# Altium schematic sheet Thermal_MGM.SchDoc: Thermal
size 420 x 297 mm; Author: G.K.; CompanyName: WUT; DrawnBy: G.K.; Organization: WUT ISE; Address1: Warsaw Univeristy of Technology; Address2: Nowowiejska 15/19; DocumentNumber: 6; Revision: -; SheetNumber: 6; SheetTotal: 7; EDA_Number: ARTIQ; Projet: ARTIQ/SINARA; ModifiedBy: -; CreateDate: XX/XX/XXXX; CheckedDate: -; Title2: management; DivGrp: ISE; Designer: G.K.; ModifiedDate: -; ProjectName: 32 CHANNEL 16bit DAC
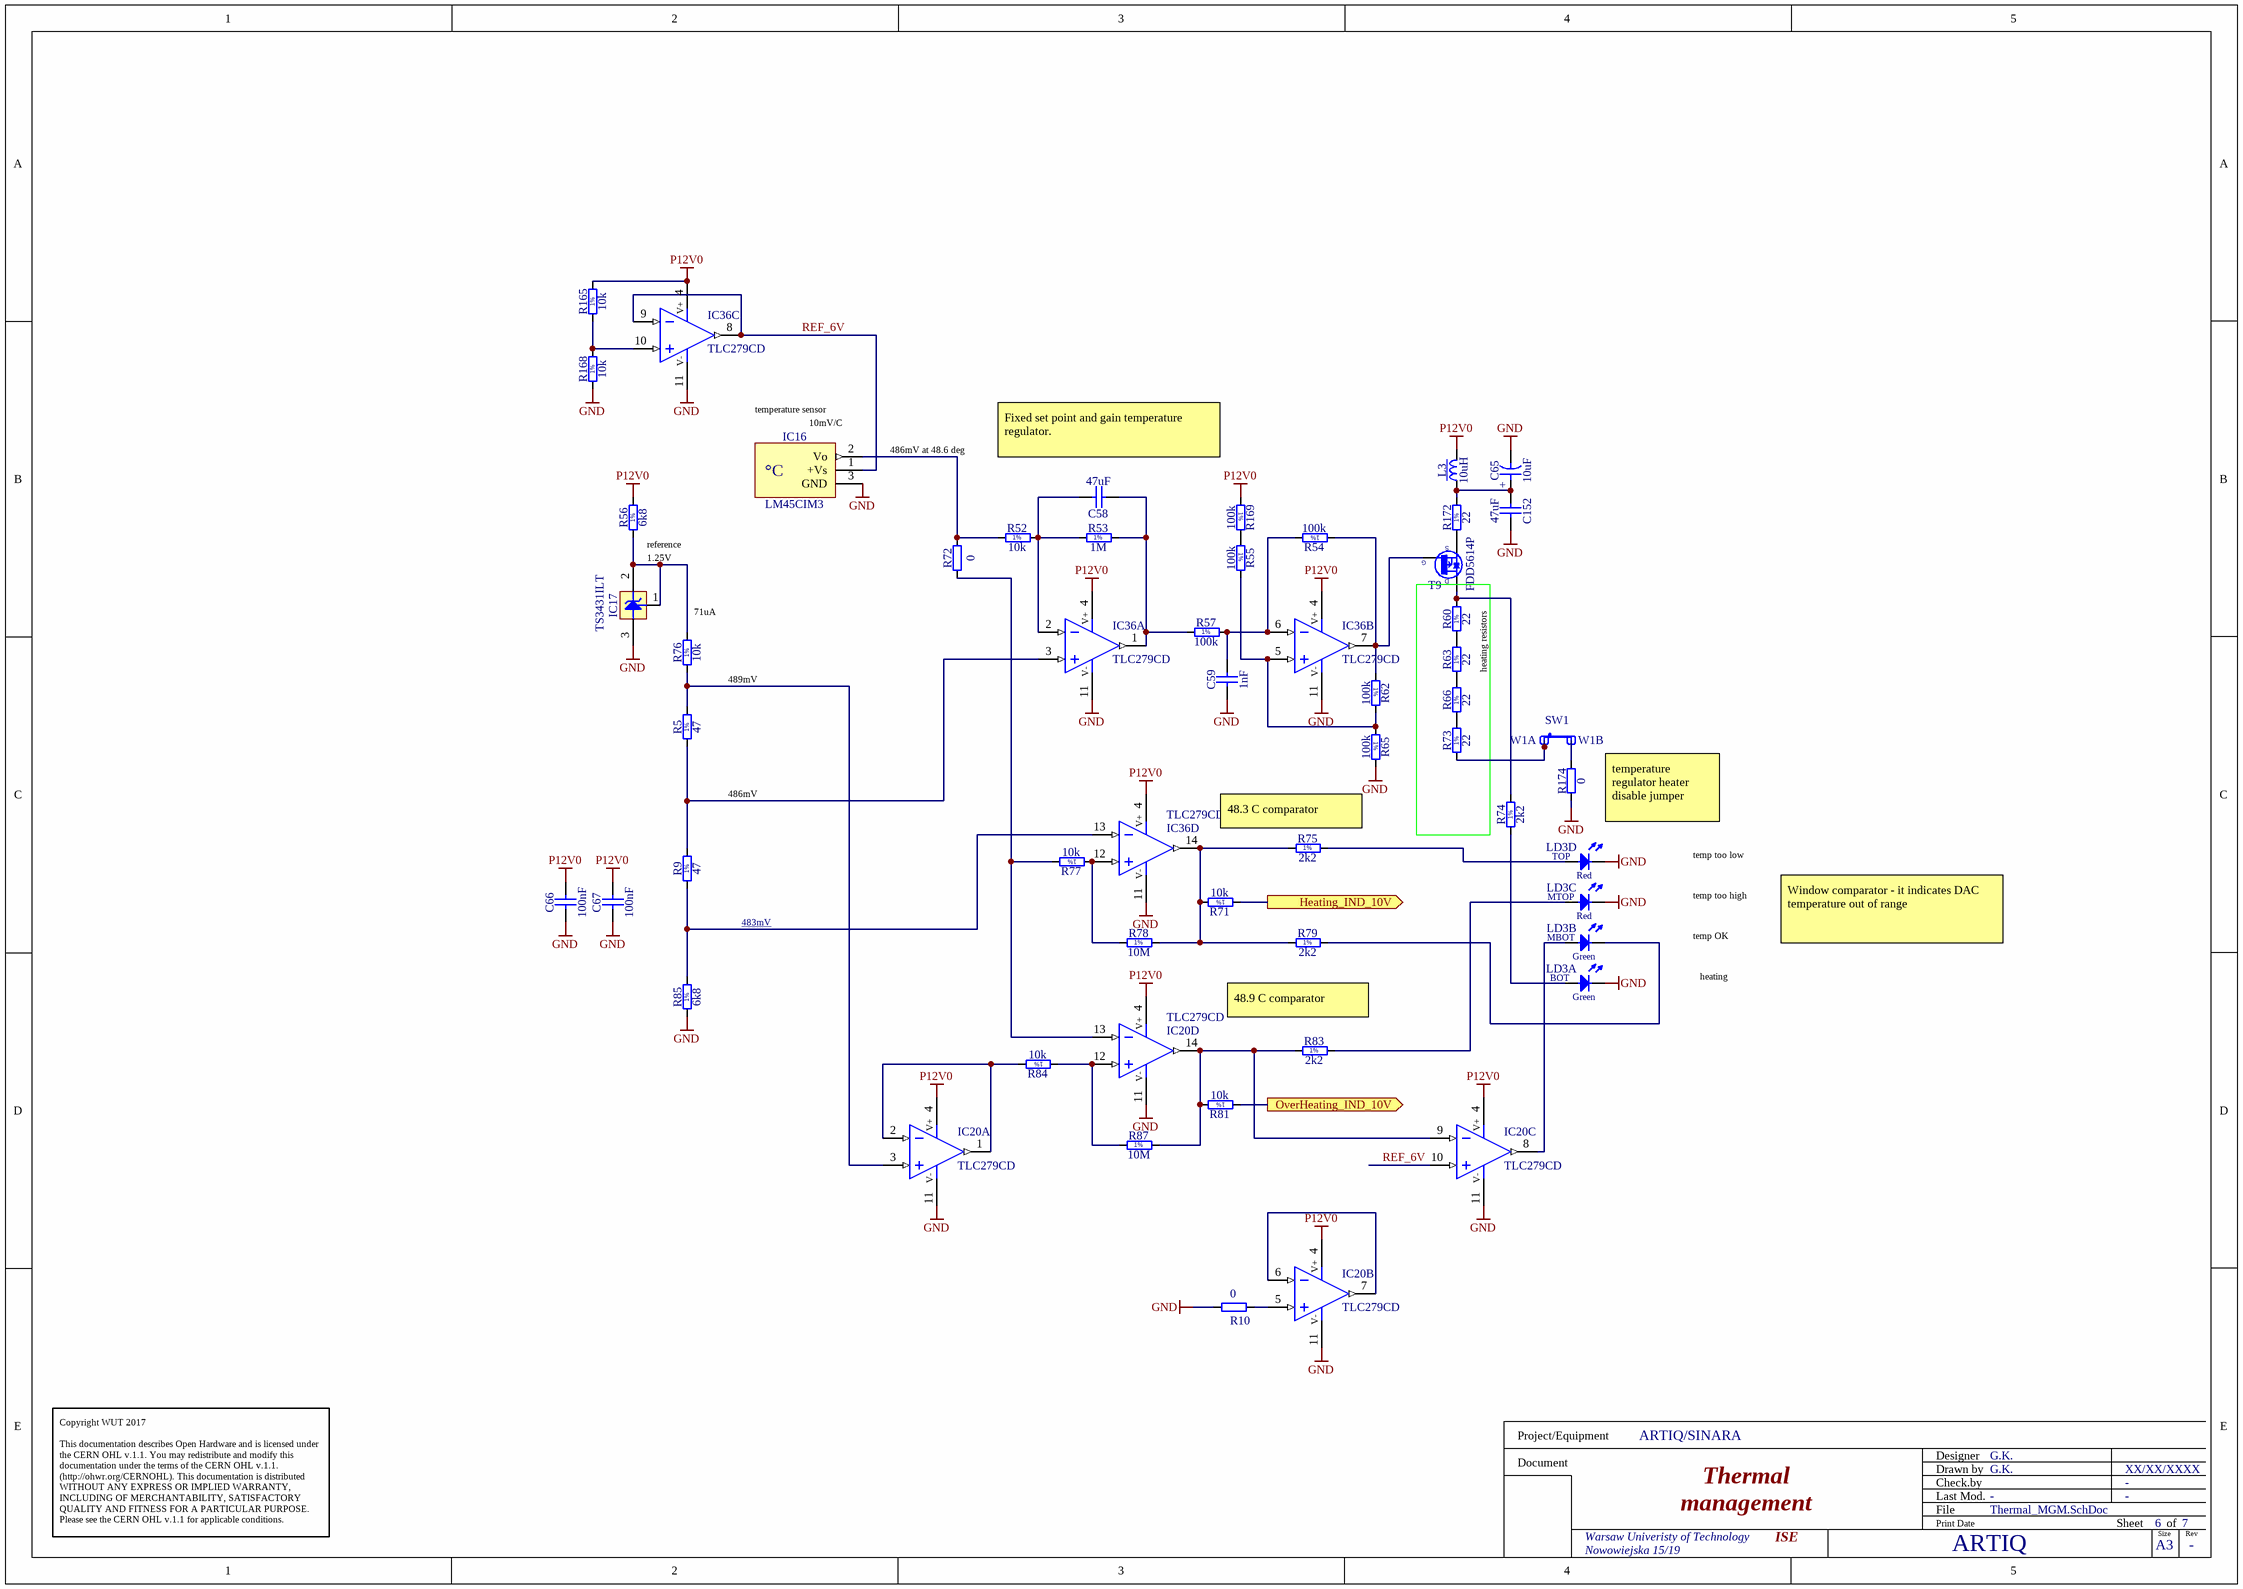
[diagram p0: Thermal_MGM.SchDoc]

## Parts
C58  47uF  [CAPC3225X270N]
C59  1nF  [CAPC1608X87N]
C65  10uF  [CAPMP3216X180N]
C66  100nF  [CAPC1005X55N]
C67  100nF  [CAPC1005X55N]
C152  47uF  [CAPC3225X270N]
IC16  LM45CIM3  [SOT95P251X112-3N]
IC17  TS3431ILT  [SOT95P237X112-3N]
IC20  TLC279CD  [SOIC127P600X175-14N]  (parts A,B,C,D of 4)
IC36  TLC279CD  [SOIC127P600X175-14N]  (parts A,B,C,D of 4)
L3  10uH  [IND_MURATA-PS_8400]
LD3  Green/Green/HeRed/HeRed  [LED_BIVAR_H485CHHGGDL]  (value not drawn)  (parts A,B,C,D of 4)
R5  47  [RESC1608X55N]
R9  47  [RESC1608X55N]
R10  0  [RESC1005X40N]
R52  10k  [RESC1608X55N]
R53  1M  [RESC1608X55N]
R54  100k  [RESC1608X55N]
R55  100k  [RESC1608X55N]
R56  6k8  [RESC1608X55N]
R57  100k  [RESC1608X55N]
R60  22  [RESC3216X65N]
R62  100k  [RESC1608X55N]
R63  22  [RESC3216X65N]
R65  100k  [RESC1608X55N]
R66  22  [RESC3216X65N]
R71  10k  [RESC1608X55N]
R72  0  [RESC1005X40N]
R73  22  [RESC3216X65N]
R74  2k2  [RESC1608X55N]
R75  2k2  [RESC1608X55N]
R76  10k  [RESC1608X55N]
R77  10k  [RESC1608X55N]
R78  10M  [RESC1508X63N]
R79  2k2  [RESC1608X55N]
R81  10k  [RESC1608X55N]
R83  2k2  [RESC1608X55N]
R84  10k  [RESC1608X55N]
R85  6k8  [RESC1608X55N]
R87  10M  [RESC1508X63N]
R165  10k  [RESC1608X55N]
R168  10k  [RESC1608X55N]
R169  100k  [RESC1608X55N]
R172  22  [RESC3216X65N]
R174  0  [RESC1005X40N]
SW1  Jumper Type1  [JUMPER_BLACK_INSULATED_2.54MM]  (value not drawn)
T9  FDD5614P  [TO228P991X238-3N-R546X521]
W1  Test Point  [COMATEL_385.0358.1.02.400]  (value not drawn)  (parts A,B of 2)

## Ports
Heating_IND_10V (out), OverHeating_IND_10V (out)

## Nets
GND: C59.1 C65.2 C66.1 C67.1 C152.2 IC16.3(GND) IC17.3(A) IC20.11(V-) IC36.11(V-) LD3.1(C) LD3.5(C) LD3.7(C) R10.2 R65.2 R85.1 R168.1 R174.1
P12V0: C66.2 C67.2 IC20.4(V+) IC36.4(V+) L3.2 R56.2 R165.2 R169.1
Heating_IND_10V: R71.1 ; port Heating_IND_10V
OverHeating_IND_10V: R81.1 ; port OverHeating_IND_10V
REF_6V: IC16.1(+Vs) IC20.10(IN+) IC36.8(OUT) IC36.9(IN-)
NetC58_1: C58.1 IC36.1(OUT) R53.2 R57.1
NetC58_2: C58.2 IC36.2(IN-) R52.2 R53.1
NetC59_2: C59.2 IC36.6(IN-) R54.2 R57.2
NetC65_1: C65.1 C152.1 L3.1 R172.2
NetIC16_2: IC16.2(Vo) R52.1 R72.2
NetIC17_1: IC17.1(Adj) IC17.2(C) R56.1 R76.2
NetIC20_1: IC20.1(OUT) IC20.2(IN-) R84.2
NetIC20_3: IC20.3(IN+) R5.2 R76.1
NetIC20_5: IC20.5(IN+) R10.1
NetIC20_6: IC20.6(IN-) IC20.7(OUT)
NetIC20_8: IC20.8(OUT) LD3.4(A)
NetIC20_9: IC20.9(IN-) IC20.14(OUT) R81.2 R83.1 R87.2
NetIC20_12: IC20.12(IN+) R84.1 R87.1
NetIC20_13: IC20.13(IN-) R72.1 R77.2
NetIC36_3: IC36.3(IN+) R5.1 R9.2
NetIC36_5: IC36.5(IN+) R55.2 R62.2 R65.1
NetIC36_7: IC36.7(OUT) R54.1 R62.1 T9.1(G)
NetIC36_10: IC36.10(IN+) R165.1 R168.2
NetIC36_12: IC36.12(IN+) R77.1 R78.1
NetIC36_13: IC36.13(IN-) R9.1 R85.2
NetIC36_14: IC36.14(OUT) R71.2 R75.1 R78.2 R79.1
NetLD3_2: LD3.2(A) R74.1
NetLD3_3: LD3.3(C) R79.2
NetLD3_6: LD3.6(A) R83.2
NetLD3_8: LD3.8(A) R75.2
NetR55_1: R55.1 R169.2
NetR60_1: R60.1 R63.2
NetR60_2: R60.2 R74.2 T9.3(D)
NetR63_1: R63.1 R66.2
NetR66_1: R66.1 R73.2
NetR73_1: R73.1 SW1.1 W1.1
NetR172_1: R172.1 T9.2(S)
NetR174_2: R174.2 W1.2

## Notes on the sheet
- temperature sensor
- (near IC16) 10mV/C
- 486mV at 48.6 deg
- Fixed set point and gain temperature regulator.
- 1.25V
- (near R56) reference
- (near R76) 71uA
- heating resistors
- 489mV
- 486mV
- (near R75) 48.3 C comparator
- temperature regulator heater disable jumper
- temp too low
- 483mV
- temp too high
- temp OK
- Window comparator - it indicates DAC temperature out of range
- heating
- 48.9 C comparator
- Copyright WUT 2017
  This documentation describes Open Hardware and is licensed under the CERN OHL v.1.1. You may redistribute and modify this documentation under the terms of the CERN OHL v.1.1. (http://ohwr.org/CERNOHL). This documentation is distributed WITHOUT ANY EXPRESS OR IMPLIED WARRANTY, INCLUDING OF MERCHANTABILITY, SATISFACTORY QUALITY AND FITNESS FOR A PARTICULAR PURPOSE. Please see the CERN OHL v.1.1 for applicable conditions.
- Project/Equipment
- Document
- Designer
- Drawn by
- Check.by
- File
- Last Mod.
- Print Date
- Sheet
- Size
- A3
- of
- Rev
- (in symbol CTE3216-18_10UF_16V_20%_AVX_TCJ) +
- (in symbol LED_BIVAR_H485CHHGGDL, part A) BOT; Green
- (in symbol LED_BIVAR_H485CHHGGDL, part B) MBOT; Green
- (in symbol LED_BIVAR_H485CHHGGDL, part C) MTOP; Red
- (in symbol LED_BIVAR_H485CHHGGDL, part D) TOP; Red
- (in symbol LM45CIM3) °C
- (in symbol R0603_1M_1%_0.1W_100PPM) 1%
- (in symbol R0603_2K2_1%_0.1W_100PPM) 1%
- (in symbol R0603_6K8_1%_0.1W_100PPM) 1%
- (in symbol R0603_10K_1%_0.1W_100PPM) 1%
- (in symbol R0603_10M_1%_0.125W_100PPM_VISHAY_CHP) 1%
- (in symbol R0603_47R_1%_0.1W_100PPM) 1%
- (in symbol R0603_100K_1%_0.1W_100PPM) 1%
- (in symbol R1206_22R_1%_0.25W_100PPM) 1%

## Library data of the parts
C58 C152 = CC1210_47UF_10V_10%_X7R: Non-polarised capacitor; Part Description: SMD Multilayer Chip Ceramic Capacitor; Manufacturer: GENERIC; Manufacturer1 Part Number: GRM32ER71A476KE15; Voltage: 10V; TC: X7R; Tolerance: ±10%; Part Number: CC1210_47UF_10V_10%_X7R; Component Kind: Standard; Component Type: Standard; Pin Count: 2; Value: 47uF; Status: None; Manufacturer Part Number: CC1210_47UF_10V_10%_X7R; Case: 1210; Mounted: Yes; Socket: No; SMD: Yes; Sense: No; Manufacturer1 Example: MURATA; Manufacturer1 ComponentHeight: 2.7mm; HelpURL: \\cern.ch\dfs\Applications\Altium\Datasheets\CC1210_X7R_MURATA.pdf; Author: CERN DEM BC; CreateDate: 18.11.2015; LatestRevisionDate: 18.11.2015
C59 = CC0603_1NF_50V_10%_X7R: Non-polarised capacitor; Part Description: SMD Multilayer Chip Ceramic Capacitor; Manufacturer: GENERIC; Manufacturer1 Part Number: 223858615623; Voltage: 50V; TC: X7R; Tolerance: ±10%; Part Number: CC0603_1NF_50V_10%_X7R; Component Kind: Standard; Component Type: Standard; Pin Count: 2; Value: 1nF; Status: Preferred; Manufacturer Part Number: CC0603_1NF_50V_10%_X7R; Case: 0603; Mounted: Yes; Socket: No; SMD: Yes; Sense: No; Manufacturer1 Example: PHYCOMP; Manufacturer1 ComponentHeight: 0.87mm; HelpURL: \\cern.ch\dfs\Applications\Altium\Datasheets\CC0603_X7R_PHYCOMP.pdf; Author: CERN DEM JLC; CreateDate: 03.12.2007; LatestRevisionDate: 03.12.2007
C65 = CTE3216-18_10UF_16V_20%_AVX_TCJ: Polarised capacitor; Part Description: ESR 0R200 Tantalum Solid Electrolytic Chip Capacitor with Conductive Polymer Electrode; Manufacturer: AVX; Manufacturer Part Number: TCJA106M016R0200; Voltage: 16V; Tolerance: ±20%; Part Number: CTE3216-18_10UF_16V_20%_AVX_TCJ; Component Kind: Standard; Component Type: Standard; Pin Count: 2; Value: 10uF; Status: Preferred; Case: A; Mounted: Yes; Socket: No; SMD: Yes; Sense: No; ComponentHeight: 1.8mm; HelpURL: \\cern.ch\dfs\Applications\Altium\Datasheets\CTE_AVX_TCJ.pdf; Author: CERN DEM JLC; CreateDate: 29.03.2012; LatestRevisionDate: 29.03.2012
C66 C67 = CC0402_100NF_16V_10%_X7R: Non-polarised capacitor; Part Description: SMD Multilayer Chip Ceramic Capacitor; Manufacturer: GENERIC; Manufacturer1 Part Number: GRM155R71C104KA88D; Voltage: 16V; TC: X7R; Tolerance: ±10%; Part Number: CC0402_100NF_16V_10%_X7R; Component Kind: Standard; Component Type: Standard; Pin Count: 2; Value: 100nF; Status: Not Recommended; Manufacturer Part Number: CC0402_100NF_16V_10%_X7R; Case: 0402; Mounted: Yes; Socket: No; SMD: Yes; Sense: No; Manufacturer1 Example: MURATA; Manufacturer1 ComponentHeight: 0.55mm; HelpURL: \\cern.ch\dfs\Applications\Altium\Datasheets\CC0402_X7R_MURATA_GRM.pdf; Author: CERN DEM JLC; CreateDate: 2013-12-05; LatestRevisionDate: 2007-12-03
IC16 = LM45CIM3: -20° to +100°C ±3°C Precision Centigrade Temperature Sensors; Manufacturer: NATIONAL SEMICONDUCTOR; PressFit: No; Bonding: No; Part Number: LM45CIM3; Component Kind: Standard; Component Type: Standard; Device: LM45CIM3; PackageDescription: SOT23 3-Leads, Pitch 0.95mm - Body 1.3x2.9mm, IPC Medium Density; Status: Obsolete; Part Description: -20° to +100°C ±3°C Precision Centigrade Temperature Sensors; Manufacturer Part Number: LM45CIM3; Pin Count: 3; Case: SOT23; Mounted: Yes; Socket: No; SMD: Yes; Sense: No; ComponentHeight: 1.12mm; HelpURL: \\cern.ch\dfs\Applications\Altium\Datasheets\LM45CIM3.pdf; Author: CERN DEM JLC; CreateDate: 02.12.2009; LatestRevisionDate: 02.12.2009
IC17 = TS3431ILT: Precision Reference 1=Adj 2=Cathode 3=Anode; Part Description: 1.24 V Programmable Shunt Voltage Reference; Manufacturer: ST MICROELECTRONICS; PressFit: No; Bonding: No; Part Number: TS3431ILT; Component Kind: Standard; Component Type: Standard; Device: TS3431ILT; PackageDescription: SOT, 0.95mm, pitch; 3 pin,1.30mm W X 2.92mm L X 1.12mm H body, IPC Medium Density; Manufacturer Part Number: TS3431ILT; Pin Count: 3; Case: SOT23; Mounted: Yes; Socket: No; SMD: Yes; Sense: No; ComponentHeight: 1.12mm; HelpURL: \\cern.ch\dfs\Applications\Altium\Datasheets\TS3431ILT.pdf; Author: CERN DEM JLC; CreateDate: 17.11.2016; LatestRevisionDate: 17.11.2016
IC20 IC36 = OA_TLC279CD: LinCMOS Precision (900uV) Quad Operational Amplifier; Part Description: LinCMOS Precision Quad Operational Amplifier; Manufacturer: TEXAS INSTRUMENTS; PressFit: No; Bonding: No; Part Number: TLC279CD; Component Kind: Standard; Component Type: Standard; Device: TLC279CD; PackageDescription: SOIC 14, Pitch 1.27mm - Body 4x8.75mm, IPC Medium Density; Manufacturer Part Number: TLC279CD; Pin Count: 14; Case: SOIC14; Mounted: Yes; Socket: No; SMD: Yes; Sense: No; ComponentHeight: 1.75mm; Author: CERN DEM JLC; HelpURL: \\cern.ch\dfs\Applications\Altium\Datasheets\TLC274CD.pdf; CreateDate: 18.01.2011; LatestRevisionDate: 18.01.2011
L3 = IND_10UH_10%_MURATA-PS_8400: Inductor With Core; Part Description: Miniature Surface Mount Power Inductor (8400 Serie); Manufacturer: MURATA POWER SOLUTIONS; Manufacturer Part Number: 84103C; Power: 950mA; Resistance: 0.24R; Tolerance: ±10%; Part Number: IND_10UH_10%_MURATA-PS_8400; Component Kind: Standard; Component Type: Standard; Pin Count: 2; Value: 10uH; Status: None; Mounted: Yes; Socket: No; SMD: Yes; Sense: No; ComponentHeight: 2.9mm; HelpURL: \\cern.ch\dfs\Applications\Altium\Datasheets\IND_MURATA-PS_8400.pdf; Author: CERN DEM JLC; CreateDate: 02.07.2012; LatestRevisionDate: 02.07.2012
LD3 = LED_BIVAR_H485CHHGGDL: LED x4 G-1C2A-BOT_G-3C4A_H-5C6A_H-7C8A-TOP; Part Description: Quad-Level 2mm (Green+Green+HeRed+HeRed) LED, PCB Edge Mounting; Manufacturer: BIVAR; PressFit: No; Bonding: No; Part Number: LED_BIVAR_H485CHHGGDL; Component Kind: Standard; Component Type: Standard; Color: Green/Green/HeRed/HeRed; PackageDescription: Quad-Level 2mm (Green+Green+HeRed+HeRed) LED, PCB Edge Mounting  BIVAR H485C Serie; Status: Not Recommanded; Manufacturer Part Number: H485CHHGGDL; Pin Count: 8; Mounted: Yes; Socket: No; SMD: No; Sense: No; ComponentHeight: 11.3mm; HelpURL: \\cern.ch\dfs\Applications\Altium\Datasheets\LED_BIVAR_H485C.pdf; Author: CERN DEM BC; CreateDate: 12.11.2015; LatestRevisionDate: 12.11.2015
R5 R9 = R0603_47R_1%_0.1W_100PPM: Resistor - 1%; Part Description: General Purpose Thick Film Chip Resistor; Manufacturer: GENERIC; Manufacturer1 Part Number: NRC06F47R0TRF; Power: 0.1W; TC: ±100ppm/°C; Part Number: R0603_47R_1%_0.1W_100PPM; Component Kind: Standard; Component Type: Standard; Pin Count: 2; Value: 47; Status: Preferred; Tolerance: ±1%; Manufacturer Part Number: R0603_47R_1%_0.1W_100PPM; Case: 0603; Mounted: Yes; Sense: No; Socket: No; SMD: Yes; Manufacturer1 Example: NIC COMPONENT; Manufacturer1 ComponentHeight: 0.55mm; HelpURL: \\cern.ch\dfs\Applications\Altium\Datasheets\R0603_NIC_NRC.pdf; Author: CERN DEM JLC; CreateDate: 03.12.2007; LatestRevisionDate: 13.03.2008
R10 R72 R174 = R0402_0R_JUMPER: Resistor; Part Description: 1A (0.05R Max DC Resistance) Zero Ohm Jumper; Manufacturer: GENERIC; Manufacturer1 Part Number: 232270591001L; Part Number: R0402_0R_JUMPER; Component Kind: Standard; Component Type: Standard; Pin Count: 2; Value: 0; Status: Not recommended; Manufacturer Part Number: R0402_0R_JUMPER; Case: 0402; Mounted: Yes; Sense: No; Socket: No; SMD: Yes; Manufacturer1 Example: YAGEO PHYCOMP; Manufacturer1 ComponentHeight: 0.4mm; HelpURL: \\cern.ch\dfs\Applications\Altium\Datasheets\R0402_Phycomp_RC0402.pdf; Author: CERN DEM JLC; CreateDate: 03.12.2007; LatestRevisionDate: 17.10.2012
R52 R71 R76 R77 R81 R84 R165 R168 = R0603_10K_1%_0.1W_100PPM: Resistor - 1%; Part Description: General Purpose Thick Film Chip Resistor; Manufacturer: GENERIC; Manufacturer1 Part Number: NRC06F1002TRF; Power: 0.1W; TC: ±100ppm/°C; Part Number: R0603_10K_1%_0.1W_100PPM; Component Kind: Standard; Component Type: Standard; Pin Count: 2; Value: 10k; Status: Preferred; Tolerance: ±1%; Manufacturer Part Number: R0603_10K_1%_0.1W_100PPM; Case: 0603; Mounted: Yes; Sense: No; Socket: No; SMD: Yes; Manufacturer1 Example: NIC COMPONENT; Manufacturer1 ComponentHeight: 0.55mm; HelpURL: \\cern.ch\dfs\Applications\Altium\Datasheets\R0603_NIC_NRC.pdf; Author: CERN DEM JLC; CreateDate: 03.12.2007; LatestRevisionDate: 13.03.2008
R53 = R0603_1M_1%_0.1W_100PPM: Resistor - 1%; Part Description: General Purpose Thick Film Chip Resistor; Manufacturer: GENERIC; Manufacturer1 Part Number: NRC06F1004TRF; Power: 0.1W; TC: ±100ppm/°C; Part Number: R0603_1M_1%_0.1W_100PPM; Component Kind: Standard; Component Type: Standard; Pin Count: 2; Value: 1M; Status: Preferred; Tolerance: ±1%; Manufacturer Part Number: R0603_1M_1%_0.1W_100PPM; Case: 0603; Mounted: Yes; Sense: No; Socket: No; SMD: Yes; Manufacturer1 Example: NIC COMPONENT; Manufacturer1 ComponentHeight: 0.55mm; HelpURL: \\cern.ch\dfs\Applications\Altium\Datasheets\R0603_NIC_NRC.pdf; Author: CERN DEM JLC; CreateDate: 03.12.2007; LatestRevisionDate: 13.03.2008
R54 R55 R57 R62 R65 R169 = R0603_100K_1%_0.1W_100PPM: Resistor - 1%; Part Description: General Purpose Thick Film Chip Resistor; Manufacturer: GENERIC; Manufacturer1 Part Number: NRC06F1003TRF; Power: 0.1W; TC: ±100ppm/°C; Part Number: R0603_100K_1%_0.1W_100PPM; Component Kind: Standard; Component Type: Standard; Pin Count: 2; Value: 100k; Status: Preferred; Tolerance: ±1%; Manufacturer Part Number: R0603_100K_1%_0.1W_100PPM; Case: 0603; Mounted: Yes; Sense: No; Socket: No; SMD: Yes; Manufacturer1 Example: NIC COMPONENT; Manufacturer1 ComponentHeight: 0.55mm; HelpURL: \\cern.ch\dfs\Applications\Altium\Datasheets\R0603_NIC_NRC.pdf; Author: CERN DEM JLC; CreateDate: 03.12.2007; LatestRevisionDate: 13.03.2008
R56 R85 = R0603_6K8_1%_0.1W_100PPM: Resistor - 1%; Part Description: General Purpose Thick Film Chip Resistor; Manufacturer: GENERIC; Manufacturer1 Part Number: NRC06F6801TRF; Power: 0.1W; TC: ±100ppm/°C; Part Number: R0603_6K8_1%_0.1W_100PPM; Component Kind: Standard; Component Type: Standard; Pin Count: 2; Value: 6k8; Status: Preferred; Tolerance: ±1%; Manufacturer Part Number: R0603_6K8_1%_0.1W_100PPM; Case: 0603; Mounted: Yes; Sense: No; Socket: No; SMD: Yes; Manufacturer1 Example: NIC COMPONENT; Manufacturer1 ComponentHeight: 0.55mm; HelpURL: \\cern.ch\dfs\Applications\Altium\Datasheets\R0603_NIC_NRC.pdf; Author: CERN DEM JLC; CreateDate: 03.12.2007; LatestRevisionDate: 13.03.2008
R60 R63 R66 R73 R172 = R1206_22R_1%_0.25W_100PPM: Resistor - 1%; Part Description: General Purpose Thick Film Chip Resistor; Manufacturer: GENERIC; Manufacturer1 Part Number: NRC12F22R0TRF; Power: 0.25W; TC: ±100ppm/°C; Part Number: R1206_22R_1%_0.25W_100PPM; Component Kind: Standard; Component Type: Standard; Pin Count: 2; Value: 22; Status: Preferred; Tolerance: ±1%; Manufacturer Part Number: R1206_22R_1%_0.25W_100PPM; Case: 1206; Mounted: Yes; Sense: No; Socket: No; SMD: Yes; Manufacturer1 Example: NIC COMPONENT; Manufacturer1 ComponentHeight: 0.65mm; HelpURL: \\cern.ch\dfs\Applications\Altium\Datasheets\R1206_NIC_NRC.pdf; Author: CERN DEM JLC; CreateDate: 03.12.2007; LatestRevisionDate: 13.03.2008
R74 R75 R79 R83 = R0603_2K2_1%_0.1W_100PPM: Resistor - 1%; Part Description: General Purpose Thick Film Chip Resistor; Manufacturer: GENERIC; Manufacturer1 Part Number: NRC06F2201TRF; Power: 0.1W; TC: ±100ppm/°C; Part Number: R0603_2K2_1%_0.1W_100PPM; Component Kind: Standard; Component Type: Standard; Pin Count: 2; Value: 2k2; Status: Preferred; Tolerance: ±1%; Manufacturer Part Number: R0603_2K2_1%_0.1W_100PPM; Case: 0603; Mounted: Yes; Sense: No; Socket: No; SMD: Yes; Manufacturer1 Example: NIC COMPONENT; Manufacturer1 ComponentHeight: 0.55mm; HelpURL: \\cern.ch\dfs\Applications\Altium\Datasheets\R0603_NIC_NRC.pdf; Author: CERN DEM JLC; CreateDate: 03.12.2007; LatestRevisionDate: 13.03.2008
R78 R87 = R0603_10M_1%_0.125W_100PPM_VISHAY_CHP: Resistor - 1%; Part Description: High Stability Metal Glaze Thick Film Chip Resistor; Manufacturer: VISHAY SFERNICE; Manufacturer Part Number: CHP0603K1005FNT; Power: 0.125W; TC: ±100ppm/°C; Part Number: R0603_10M_1%_0.125W_100PPM_VISHAY_CHP; Component Kind: Standard; Component Type: Standard; Pin Count: 2; Value: 10M; Status: None; Tolerance: ±1%; Case: 0603; Mounted: Yes; Sense: No; Socket: No; SMD: Yes; HelpURL: \\cern.ch\dfs\Applications\Altium\Datasheets\R0603_VISHAY_CHP.pdf; Author: CERN DEM JLC; CreateDate: 22.06.2011; LatestRevisionDate: 22.06.2011; ComponentHeight: 0.63mm
SW1 = COMATEL_313.1730.0.00.40.0: Jumper 1 Pin; Part Description: Closed Insulated Black Jumper Pitch 2.54mm; Manufacturer: KONTEK COMATEL; PressFit: No; SCEM: 09.55.10.960.9; Part Number: COMATEL_313.1730.0.00.40.0; Component Kind: Standard; Component Type: Standard; Pin Count: 1; Family: Jumper; Mounted: Yes; Socket: No; SMD: No; Sense: No; Status: Obsolete; Manufacturer Part Number: 313.1730.0.00.40.0; ComponentHeight: 6.5mm; HelpURL: \\cern.ch\dfs\Applications\Altium\Datasheets\COMATEL_313.1730.0.00.40.0.pdf; Author: CERN DEM JLC; CreateDate: 09.04.2008; LatestRevisionDate: 27.08.2013
T9 = FDD5614P: P-CHANNEL MOSFET WITH DIODE; Part Description: -60V -15A P-Channel PowerTrench® MOSFET; Manufacturer: FAIRCHILD SEMICONDUCTOR; PressFit: No; Bonding: No; Part Number: FDD5614P; Component Kind: Standard; Component Type: Standard; Device: FDD5614P; PackageDescription: TO-252AA DPAK TO, 2.28mm pitch; 2 pin,9.905mm L X 6.095mm W X 2.38mm H body, IPC Medium Density; Manufacturer Part Number: FDD5614P; Pin Count: 3; Case: DPAK; Mounted: Yes; Socket: No; SMD: Yes; Sense: No; ComponentHeight: 2.38mm; HelpURL: \\cern.ch\dfs\Applications\Altium\Datasheets\FDD5614P.pdf; Author: CERN DEM JLC; CreateDate: 23.09.2009; LatestRevisionDate: 23.09.2009
W1 = COMATEL_385.0358.1.02.400: 2 Mini Wire-Wrap Contact Strip Header; Part Description: 2 Contacts Straight Strip Header Pitch 2.54mm L=6.3mm ''Mini-Wire-Wrap''; Manufacturer: KONTEK COMATEL; PressFit: No; Part Number: COMATEL_385.0358.1.02.400; Component Kind: Standard; Component Type: Standard; Pin Count: 2; Family: Test Point; Mounted: Yes; Socket: No; SMD: No; Sense: No; Status: Not recommended; Manufacturer Part Number: 385.0358.1.02.400; ComponentHeight: 8mm; HelpURL: \\cern.ch\dfs\Applications\Altium\Datasheets\COMATEL_385.0358.1.02.400.pdf; Author: CERN DEM JLC; CreateDate: 30.06.2010; LatestRevisionDate: 10.10.2012